# Altium schematic sheet PHONO_PREAMP.SchDoc: =DocumentName
size 297 x 209 mm; CompanyName: "AS Manufacturing" LLC; Organization: "AS Manufacturing" LLC; Address1: 5 Sklyarenka St.; Address2: Kyiv 04073; Address3: Ukraine; Address4: https://ajax.systems/en/; DocumentNumber: 5; SheetNumber: 5; SheetTotal: 6; Template_version: 1.0.1
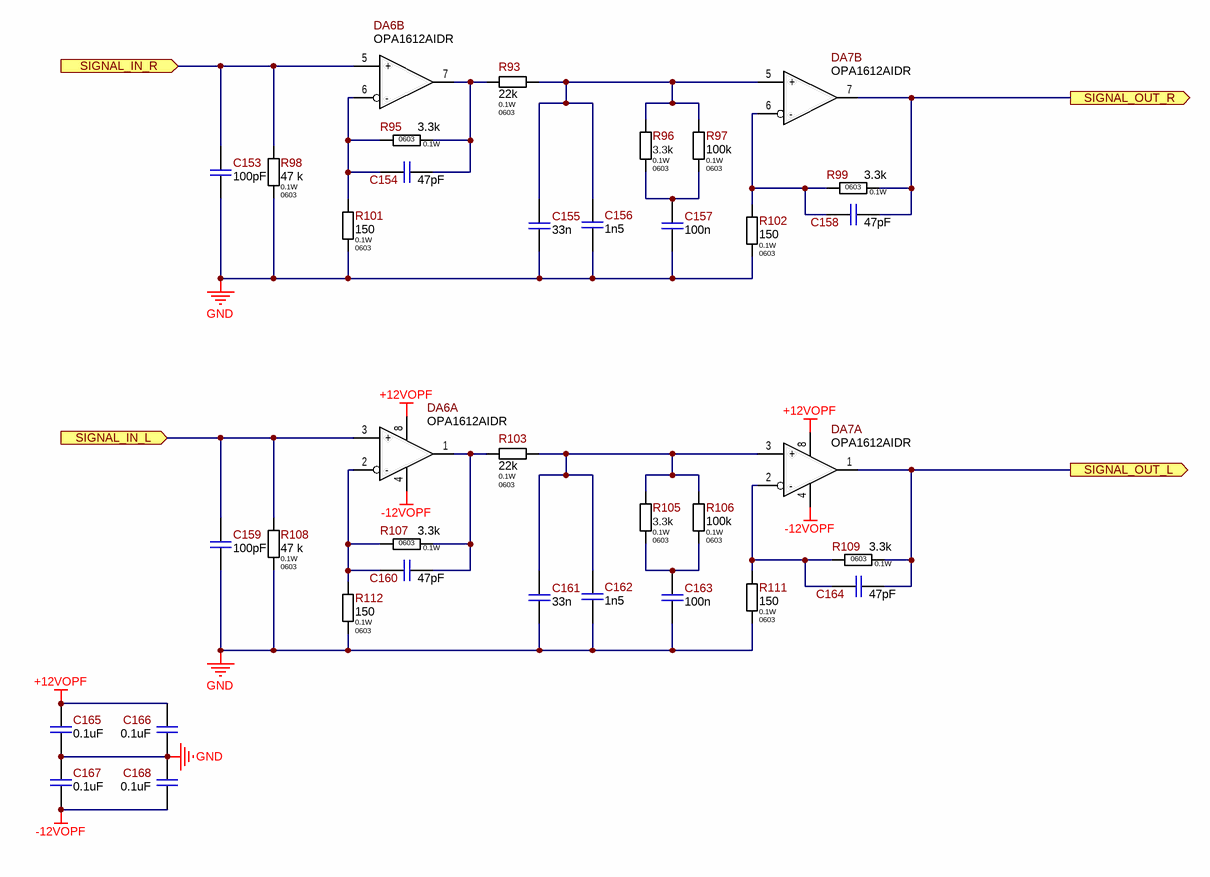
[diagram p0: PHONO_PREAMP.SchDoc]

## Parts
C153  100pF  [C0603(1608)]
C154  47pF  [C0603(1608)]
C155  33n  [WIMA_2,5x6,5x7,2]
C156  1n5  [C0603(1608)]
C157  100n  [WIMA_2,5x6,5x7,2]
C158  47pF  [C0603(1608)]
C159  100pF  [C0603(1608)]
C160  47pF  [C0603(1608)]
C161  33n  [WIMA_2,5x6,5x7,2]
C162  1n5  [C0603(1608)]
C163  100n  [WIMA_2,5x6,5x7,2]
C164  47pF  [C0603(1608)]
C165  0.1uF  [C0603(1608)]
C166  0.1uF  [C0603(1608)]
C167  0.1uF  [C0603(1608)]
C168  0.1uF  [C0603(1608)]
DA6  OPA1612AIDR  [SOIC8]  (parts A,B of 2)
DA7  OPA1612AIDR  [SOIC8]  (parts A,B of 2)
R93  22k  Power Rating: 0.1W  Package/Case: 0603  [R0603]
R95  3.3k  Power Rating: 0.1W  Package/Case: 0603  [R0603]
R96  3.3k  Power Rating: 0.1W  Package/Case: 0603  [R0603]
R97  100k  Power Rating: 0.1W  Package/Case: 0603  [R0603]
R98  47 k  Power Rating: 0.1W  Package/Case: 0603  [R0603]
R99  3.3k  Power Rating: 0.1W  Package/Case: 0603  [R0603]
R101  150  Power Rating: 0.1W  Package/Case: 0603  [R0603]
R102  150  Power Rating: 0.1W  Package/Case: 0603  [R0603]
R103  22k  Power Rating: 0.1W  Package/Case: 0603  [R0603]
R105  3.3k  Power Rating: 0.1W  Package/Case: 0603  [R0603]
R106  100k  Power Rating: 0.1W  Package/Case: 0603  [R0603]
R107  3.3k  Power Rating: 0.1W  Package/Case: 0603  [R0603]
R108  47 k  Power Rating: 0.1W  Package/Case: 0603  [R0603]
R109  3.3k  Power Rating: 0.1W  Package/Case: 0603  [R0603]
R111  150  Power Rating: 0.1W  Package/Case: 0603  [R0603]
R112  150  Power Rating: 0.1W  Package/Case: 0603  [R0603]

## Ports
SIGNAL_IN_L (in), SIGNAL_IN_R (in), SIGNAL_OUT_L (out), SIGNAL_OUT_R (out)

## Nets
+12VOPF: C165.1 C166.1 DA6.8(V+) DA7.8(V+)
-12VOPF: C167.2 C168.2 DA6.4(V-) DA7.4(V-)
GND: C153.1 C155.1 C156.2 C157.1 C159.1 C161.1 C162.2 C163.1 C165.2 C166.2 C167.1 C168.1 R98.1 R101.1 R102.1 R108.1 R111.1 R112.1
SIGNAL_IN_L: C159.2 DA6.3(+) R108.2 ; port SIGNAL_IN_L
SIGNAL_IN_R: C153.2 DA6.5(+) R98.2 ; port SIGNAL_IN_R
SIGNAL_OUT_L: C164.1 DA7.1(Out) R109.2 ; port SIGNAL_OUT_L
SIGNAL_OUT_R: C158.1 DA7.7(Out) R99.2 ; port SIGNAL_OUT_R
NetC154_1: C154.1 DA6.7(Out) R93.1 R95.2
NetC154_2: C154.2 DA6.6(-) R95.1 R101.2
NetC155_2: C155.2 C156.1 DA7.5(+) R93.2 R96.2 R97.2
NetC157_2: C157.2 R96.1 R97.1
NetC158_2: C158.2 DA7.6(-) R99.1 R102.2
NetC160_1: C160.1 DA6.1(Out) R103.1 R107.2
NetC160_2: C160.2 DA6.2(-) R107.1 R112.2
NetC161_2: C161.2 C162.1 DA7.3(+) R103.2 R105.2 R106.2
NetC163_2: C163.2 R105.1 R106.1
NetC164_2: C164.2 DA7.2(-) R109.1 R111.2

## Notes on the sheet
- 1
- 2
- 3
- 4
- 5
- 6
- C
- D
- E
- F
- Назва проекту
- Мова
- UA
- Розробник
- Формат
- A4
- Версія
- Дата
- Лист
- /

## Library data of the parts
C153 C159 = 100pF  50V C0603: CAP CER n1F 50V X7R 0603; Manufacturer: AVX Corporation; Manufacturer P/N: 06035C101MAT2A; Name Component: Capacitor Ceramic; Tolerance: ±20%; Operation Temperature: -55°C ~ 105°C; Notes: 06035C101MAT4A; Library Path 1: Capacitors.SchLib; Part Number: 100pF  50V C0603; Value: 100pF; Temperature Coefficient: X7R; Power (V/A): 50V; Package/Case: C0603; Supplier 1: Digi-key; Supplier Part Number 1: 06035C101MAT2A-ND; ComponentLink1Description: Datasheet; ComponentLink1URL: http://catalogs.avx.com/SurfaceMount.pdf
C154 C156 C158 C160 C162 C164 = 100pF  50V C0603: CAP CER n1F 50V X7R 0603; Manufacturer: AVX Corporation; Manufacturer P/N: 06035C101MAT2A; Name Component: Capacitor Ceramic; Value: 100pF; Tolerance: ±20%; Operation Temperature: -55°C ~ 105°C; Notes: 06035C101MAT4A; Library Path 1: Capacitors.SchLib; Part Number: 100pF  50V C0603; Temperature Coefficient: X7R; Power (V/A): 50V; Package/Case: C0603; Supplier 1: Digi-key; Supplier Part Number 1: 06035C101MAT2A-ND; ComponentLink1Description: Datasheet; ComponentLink1URL: http://catalogs.avx.com/SurfaceMount.pdf
C155 C161 = 33n  AC40V DC63V 2,5x6,5x7,2: WIMA 33NF, 40VAC, 63VDC: 5mm, ± 10%; Manufacturer P/N: MKS2-33N/63; Name Component: Polypropylene (PP), Metallized; Temperature Coefficient: pp; Library Path 1: Capacitors.SchLib; Part Number: 33n  AC40V DC63V 2,5x6,5x7,2; Value: 33n; Tolerance: 10%; Power (V/A): AC40V DC63V; Package/Case: 2,5x6,5x7,2; Manufacturer: WIMA; Supplier 1: kosmodrom; ComponentLink1Description: Datasheet
C157 C163 = 100n  AC40V DC63V 2,5x6,5x7,2: WIMA 100NF, 40VAC, 63VDC: 5mm, ± 10%; Manufacturer P/N: MKS2-100N/63; Name Component: Polypropylene (PP), Metallized; Temperature Coefficient: pp; Library Path 1: Capacitors.SchLib; Part Number: 100n  AC40V DC63V 2,5x6,5x7,2; Value: 100n; Tolerance: 10%; Power (V/A): AC40V DC63V; Package/Case: 2,5x6,5x7,2; Manufacturer: WIMA; Supplier 1: kosmodrom; ComponentLink1Description: Datasheet
C165-C168 = 0.1uF  50V C0603: CAP CER 0.1UF 50V X7R 0603; Manufacturer: Samsung Electro-Mechanics; Manufacturer P/N: CL10B104KB8WPNC; Name Component: Capacitor Ceramic; Tolerance: ±10%; Operation Temperature: -55°C ~ 125°C; Notes: 06035C104K4T4A, 06035C104K4T2A; Library Path 1: Capacitors.SchLib; Part Number: 0.1uF  50V C0603; Value: 0.1uF; Temperature Coefficient: X7R; Power (V/A): 50V; Package/Case: C0603; Supplier 1: Digi-key; Supplier Part Number 1: 1276-6854-2-ND; ComponentLink1Description: Datasheet; ComponentLink1URL: https://www.samsungsem.com/resources/file/global/support/product_catalog/MLCC.pdf
DA6 DA7 = OPA1612AIDR: Audio Amplifier 2 Circuit Rail-to-Rail 8-SOIC; Manufacturer: Texas Instruments; Name Component: Operational amplifier; Operation Temperature: -40°C ~ 85°C; Power (V/A): 4.5V-36; Library Path 1: Integrated Circuit.SchLib; ComponentLink1URL: https://www.ti.com/general/docs/suppproductinfo.tsp?distId=10&gotoUrl=https%3A%2F%2Fwww.ti.com%2Flit%2Fgpn%2Fopa1611; ComponentLink1Description: Datasheet; Part Number: OPA1612AIDR; Value: OPA1612AIDR; Package/Case: 8-SOIC; Manufacturer P/N: OPA1612AIDR; Supplier 1: Digi-key; Supplier Part Number 1: 296-39098-6-ND
R93 R97 R103 R106 = 750  R0603: RES SMD 750 OHM  ±1% 1/10W 0603; Name Component: Resistror; Value: 750; Operation Temperature: -55℃ to 155℃; Temperature Coefficient: ±100 ppm/°C; Library Path 1: Resistor.SchLib; Part Number: 750  R0603; Tolerance: ±1%
R95 R96 R99 R105 R107 R109 = 100 k  R0603: RES SMD 100 k OHM  ±1% 1/10W 0603; Name Component: Resistror; Value: 100 k; Operation Temperature: -55℃ to 155℃; Temperature Coefficient: ±100 ppm/°C; Library Path 1: Resistor.SchLib; Part Number: 100 k  R0603; Tolerance: ±1%
R98 R108 = 47 k  R0603: RES SMD 47 k OHM  ±1% 1/10W 0603; Name Component: Resistror; Operation Temperature: -55℃ to 155℃; Temperature Coefficient: ±100 ppm/°C; Library Path 1: Resistor.SchLib; Part Number: 47 k  R0603; Value: 47 k; Tolerance: ±1%
R101 R102 R111 R112 = 4.7 k  R0603: RES SMD 4.7 k OHM  ±1% 1/10W 0603; Name Component: Resistror; Value: 4.7 k; Operation Temperature: -55℃ to 155℃; Temperature Coefficient: ±100 ppm/°C; Library Path 1: Resistor.SchLib; Part Number: 4.7 k  R0603; Tolerance: ±1%